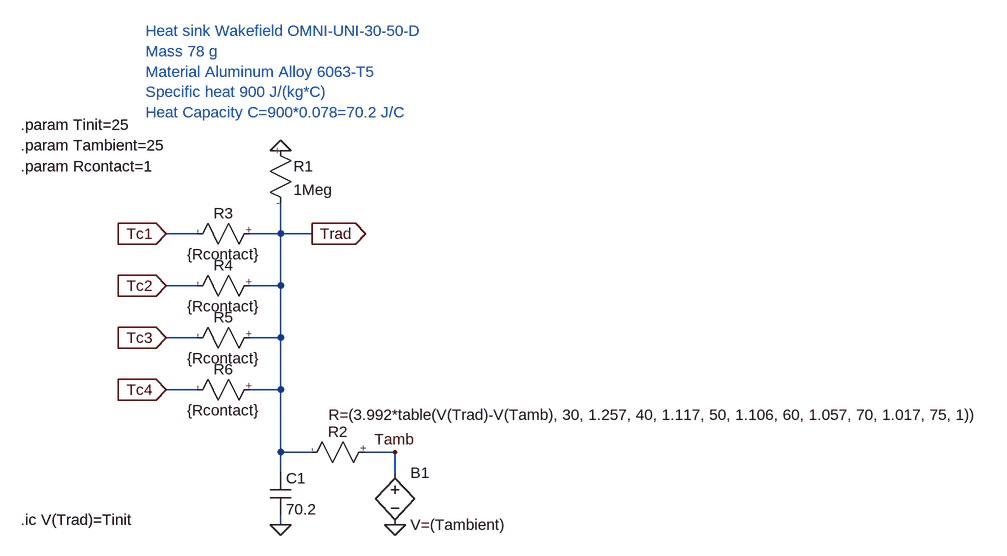
[diagram p0: schematic Radiator.asc]
Radiator.asc, the LTspice schematic file:
Version 4
SHEET 1 1676 680
WIRE 144 80 96 80
WIRE 272 80 272 32
WIRE 272 80 224 80
WIRE 320 80 272 80
WIRE 144 160 96 160
WIRE 272 160 272 80
WIRE 272 160 224 160
WIRE 144 240 96 240
WIRE 272 240 272 160
WIRE 272 240 224 240
WIRE 144 320 96 320
WIRE 272 320 272 240
WIRE 272 320 224 320
WIRE 272 416 272 320
WIRE 320 416 272 416
WIRE 448 416 400 416
WIRE 272 448 272 416
WIRE 448 448 448 416
WIRE 272 528 272 512
FLAG 96 80 Tc1
IOPIN 96 80 In
FLAG 96 160 Tc2
IOPIN 96 160 In
FLAG 96 240 Tc3
IOPIN 96 240 In
FLAG 96 320 Tc4
IOPIN 96 320 In
FLAG 448 528 0
FLAG 448 416 Tamb
FLAG 320 80 Trad
IOPIN 320 80 Out
FLAG 272 528 0
FLAG 272 -48 0
SYMBOL bv 448 432 R0
SYMATTR InstName B1
SYMATTR Value V=(Tambient)
SYMBOL cap 256 448 R0
SYMATTR InstName C1
SYMATTR Value 70.2
SYMBOL res 256 -64 R0
SYMATTR InstName R1
SYMATTR Value 1Meg
SYMBOL res 416 400 R90
WINDOW 0 0 56 VBottom 2
WINDOW 3 -57 -436 VTop 2
SYMATTR InstName R2
SYMATTR Value R=(3.992*table(V(Trad)-V(Tamb), 30, 1.257, 40, 1.117, 50, 1.106, 60, 1.057, 70, 1.017, 75, 1))
SYMBOL res 240 64 R90
WINDOW 0 0 56 VBottom 2
WINDOW 3 32 56 VTop 2
SYMATTR InstName R3
SYMATTR Value {Rcontact}
SYMBOL res 240 144 R90
WINDOW 0 0 56 VBottom 2
WINDOW 3 32 56 VTop 2
SYMATTR InstName R4
SYMATTR Value {Rcontact}
SYMBOL res 240 224 R90
WINDOW 0 0 56 VBottom 2
WINDOW 3 32 56 VTop 2
SYMATTR InstName R5
SYMATTR Value {Rcontact}
SYMBOL res 240 304 R90
WINDOW 0 0 56 VBottom 2
WINDOW 3 32 56 VTop 2
SYMATTR InstName R6
SYMATTR Value {Rcontact}
TEXT -128 -56 Left 2 !.param Tambient=25
TEXT 64 -232 Left 2 ;Heat sink Wakefield OMNI-UNI-30-50-D\nMass 78 g\nMaterial Aluminum Alloy 6063-T5\nSpecific heat 900 J/(kg*C)\nHeat Capacity C=900*0.078=70.2 J/C
TEXT -128 -24 Left 2 !.param Rcontact=1
TEXT -128 520 Left 2 !.ic V(Trad)=Tinit
TEXT -128 -88 Left 2 !.param Tinit=25

The netlist it stands for:
* Radiator.asc
B1 Tamb 0 V=(Tambient)
C1 Trad 0 70.2
R1 0 Trad 1Meg
R2 Tamb Trad R=(3.992*table(V(Trad)-V(Tamb), 30, 1.257, 40, 1.117, 50, 1.106, 60, 1.057, 70, 1.017, 75, 1))
R3 Trad Tc1 {Rcontact}
R4 Trad Tc2 {Rcontact}
R5 Trad Tc3 {Rcontact}
R6 Trad Tc4 {Rcontact}
.param Tambient=25
* Heat sink Wakefield OMNI-UNI-30-50-D
* Mass 78 g
* Material Aluminum Alloy 6063-T5
* Specific heat 900 J/(kg*C)
* Heat Capacity C=900*0.078=70.2 J/C
.param Rcontact=1
.ic V(Trad)=Tinit
.param Tinit=25
.backanno
.end